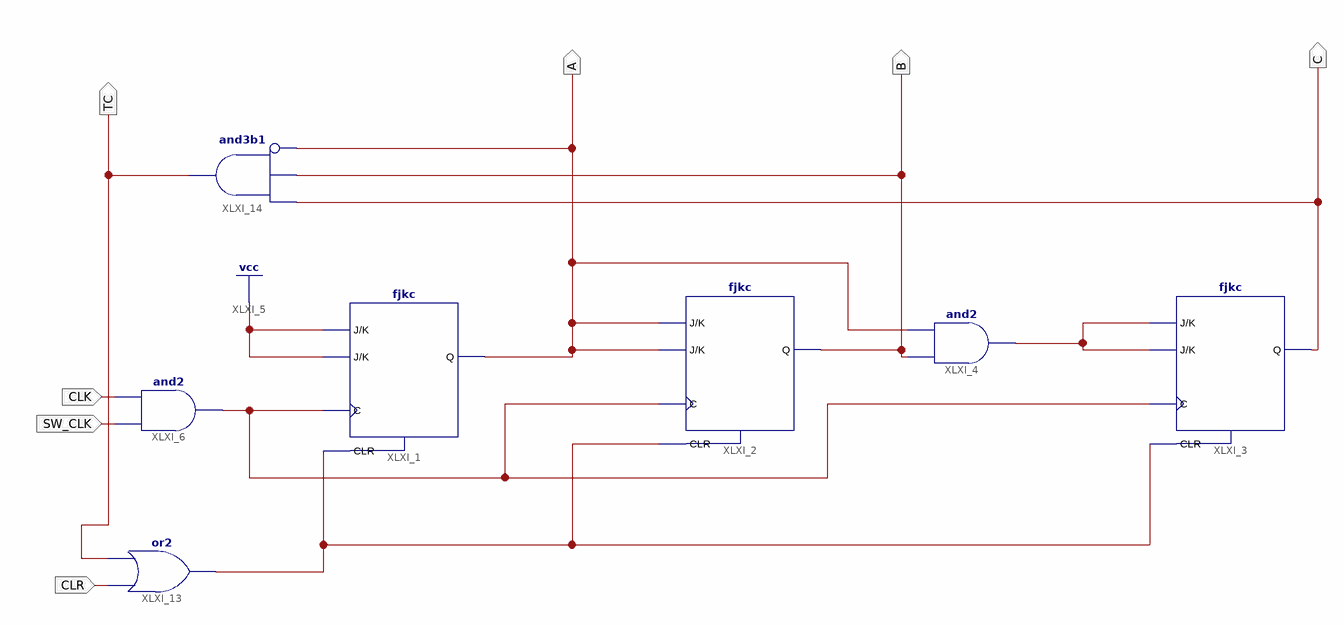
[diagram p0: schematic sheet 1]
// Xilinx ISE schematic NUM_1_6_CLK_SW_CLK.sch (spartan6) as structural Verilog: 7 symbols, 7 ports
module NUM_1_6_CLK_SW_CLK (
  input  CLK,
  input  SW_CLK,
  input  CLR,
  output B,
  output A,
  output C,
  output TC
);

  wire XLXN_2, XLXN_9, XLXN_11;

  fjkc XLXI_1 (.C(XLXN_11), .CLR(XLXN_9), .J(1'b1), .K(1'b1), .Q(A));
  fjkc XLXI_2 (.C(XLXN_11), .CLR(XLXN_9), .J(A), .K(A), .Q(B));
  fjkc XLXI_3 (.C(XLXN_11), .CLR(XLXN_9), .J(XLXN_2), .K(XLXN_2), .Q(C));
  and XLXI_4 (XLXN_2, B, A);
  and XLXI_6 (XLXN_11, SW_CLK, CLK);
  or XLXI_13 (XLXN_9, CLR, TC);
  and XLXI_14 (TC, ~A, B, C);  // and3b1
endmodule
